# EAGLE design PCB-BC-BI (EAGLE 7.3.0)
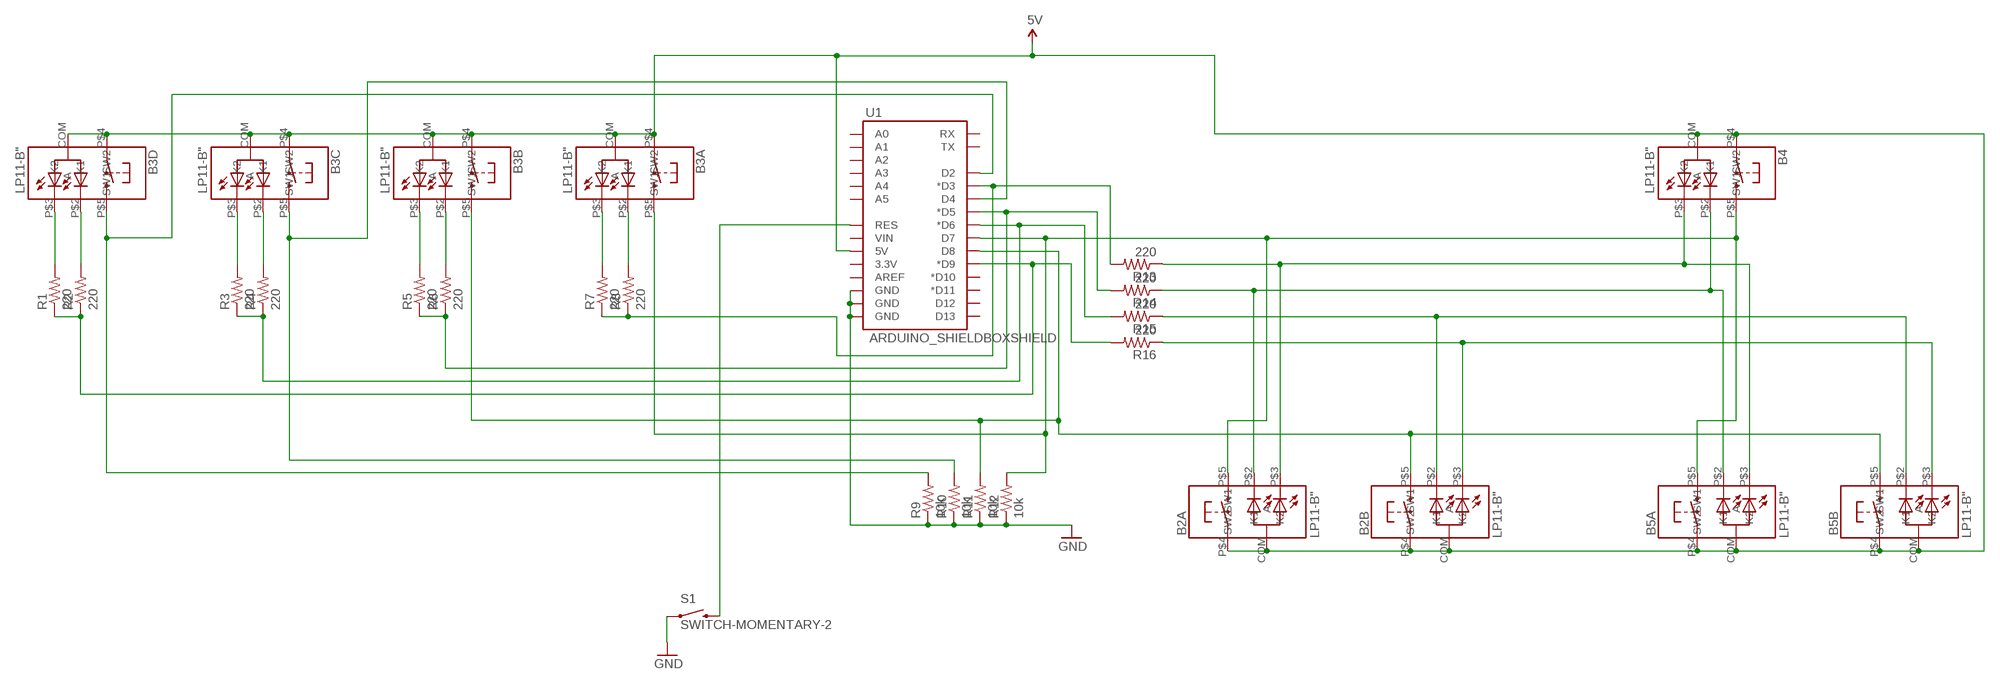
[diagram p0: schematic, sheet 1]

## Parts
B2A  LP11-B"  [LP11]
B2B  LP11-B"  [LP11]
B3A  LP11-B"  [LP11]
B3B  LP11-B"  [LP11]
B3C  LP11-B"  [LP11]
B3D  LP11-B"  [LP11]
B4  LP11-B"  [LP11]
B5A  LP11-B"  [LP11]
B5B  LP11-B"  [LP11]
R1  220  RESISTOR0603-RES  [0603-RES]
R2  220  RESISTOR0603-RES  [0603-RES]
R3  220  RESISTOR0603-RES  [0603-RES]
R4  220  RESISTOR0603-RES  [0603-RES]
R5  220  RESISTOR0603-RES  [0603-RES]
R6  220  RESISTOR0603-RES  [0603-RES]
R7  220  RESISTOR0603-RES  [0603-RES]
R8  220  RESISTOR0603-RES  [0603-RES]
R9  10k  RESISTOR0603-RES  [0603-RES]
R10  10k  RESISTOR0603-RES  [0603-RES]
R11  10k  RESISTOR0603-RES  [0603-RES]
R12  10k  RESISTOR0603-RES  [0603-RES]
R13  220  RESISTOR0603-RES  [0603-RES]
R14  220  RESISTOR0603-RES  [0603-RES]
R15  220  RESISTOR0603-RES  [0603-RES]
R16  220  RESISTOR0603-RES  [0603-RES]
S1  SWITCH-MOMENTARY-2  [TACTILE_SWITCH_TALL]
U1  ARDUINO_SHIELDBOXSHIELD  [ARDUINO_BOXSHIELD]

## Nets
5V: B2A.COM(A) B2A.P$4(SW1) B2B.COM(A) B2B.P$4(SW1) B3A.COM(A) B3A.P$4(SW1) B3B.COM(A) B3B.P$4(SW1) B3C.COM(A) B3C.P$4(SW1) B3D.COM(A) B3D.P$4(SW1) B4.COM(A) B4.P$4(SW1) B5A.COM(A) B5A.P$4(SW1) B5B.COM(A) B5B.P$4(SW1) U1.5V@0(5V)
GND: R9.1 R10.1 R11.1 R12.1 S1.A2 U1.GND@0(GND) U1.GND@1(GND) U1.GND@4(GND)
N$2: B3D.P$3(K2) R1.2
N$3: B2A.P$3(K2) B4.P$3(K2) B5A.P$3(K2) R13.1
N$4: B3D.P$2(K1) R2.2
N$5: B3C.P$3(K2) R3.2
N$6: B3C.P$2(K1) R4.2
N$7: B3C.P$5(SW2) R10.2 U1.4(D4)
N$8: R5.1 R6.1 R14.2 U1.5(*D5)
N$9: R3.1 R4.1 R15.2 U1.6(*D6)
N$10: R1.1 R2.1 R16.2 U1.9(*D9)
N$11: B2B.P$5(SW2) B3B.P$5(SW2) B5B.P$5(SW2) R11.2 U1.8(D8)
N$12: B2A.P$2(K1) B4.P$2(K1) B5A.P$2(K1) R14.1
N$13: B2B.P$2(K1) B5B.P$2(K1) R15.1
N$14: B2B.P$3(K2) B5B.P$3(K2) R16.1
N$15: B2A.P$5(SW2) B3A.P$5(SW2) B4.P$5(SW2) B5A.P$5(SW2) R12.2 U1.7(D7)
N$16: B3B.P$3(K2) R5.2
N$17: B3B.P$2(K1) R6.2
N$18: B3A.P$3(K2) R7.2
N$19: B3A.P$2(K1) R8.2
N$20: B3D.P$5(SW2) R9.2 U1.2(D2)
N$21: R7.1 R8.1 R13.2 U1.3(*D3)
N$23: S1.B2 U1.RESET(RES)
Unconnected: U1.0(RX) U1.1(TX) U1.3.3V U1.10(*D10) U1.11(*D11) U1.12(D12) U1.13(D13) U1.A0 U1.A1 U1.A2 U1.A3 U1.A4 U1.A5 U1.AREF U1.VIN

## Library data of the parts
B2A B2B B3A B3B B3C B3D B4 B5A B5B = SKAARHOJ:LP11-B
R1-R16 = SparkFun:RESISTOR: Resistor Basic schematic elements and footprints for 0603, 1206, and PTH resistors.
S1 = SparkFun:SWITCH-MOMENTARY-2
U1 = SKAARHOJ:ARDUINO_SHIELD

## Board
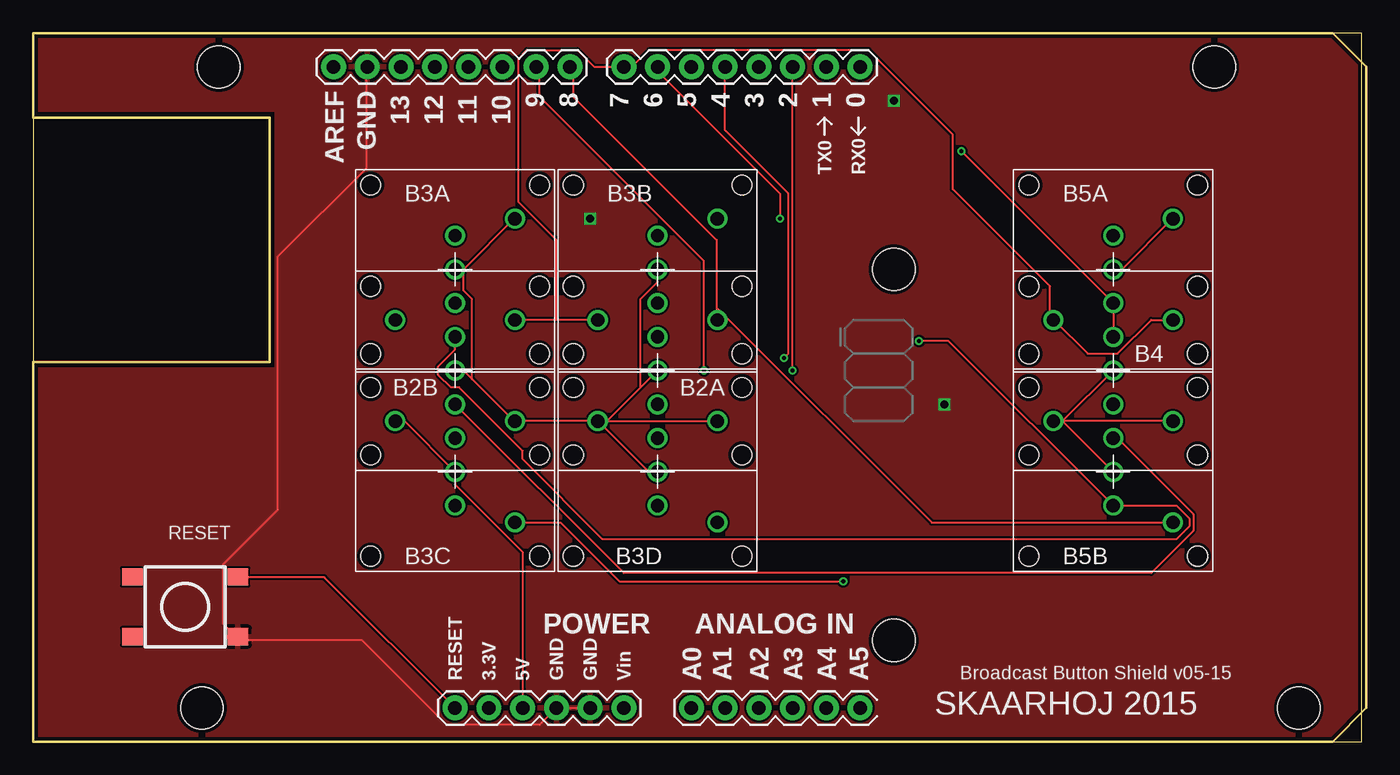
[diagram p1: board, top side]
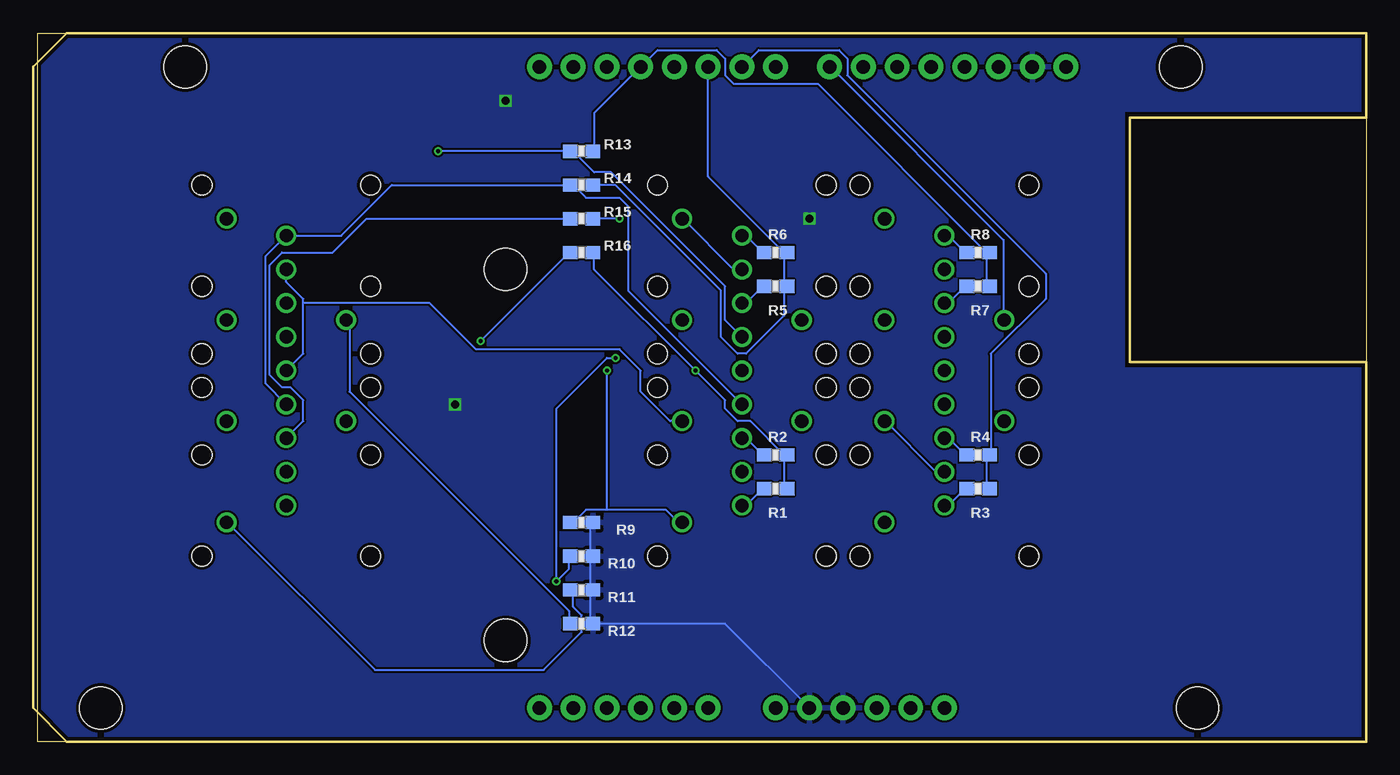
[diagram p2: board, bottom side, seen from below]

Size 100 x 53.33 mm. Coordinates in mm from the lower left corner, seen from the top.
Outline: 0,0 100,0 100,53.33 0,53.33 0,0
Copper layers (1*16): Top 0.035mm / dielectric 1.5mm / Bottom 0.035mm
Design rules "default": minimum track width 6mil, minimum drill 12mil, track to track 6mil, track to pad 6mil, pad to pad 6mil, via to via 6mil, smd to smd 0mil, copper to edge 10mil, drill to drill 10mil, minimum pad ring 10mil, minimum via ring 6mil, stop-mask expansion 2mil, vias tented up to drill 100mil, thermal gap 10mil

### Footprints (pad centres in the part's own frame; a part is rotated, then mirrored left to right if it is on the bottom)
LP11 = drill 1: COM 0,0; P$2 0,2.54; P$3 0,-2.54; P$4 4.5,3.81; P$5 4.5,-3.81 | hole 1.5: -6.35,6.35; 6.35,6.35; 6.35,-6.35; -6.35,-6.35
0603-RES = smd 1.1 x 1: 1 -0.85,0; 2 0.85,0
TACTILE_SWITCH_TALL = smd 1.55 x 1.3: A1 -3.975,-2.25; A2 3.975,-2.25; B1 -3.975,2.25; B2 3.975,2.25
ARDUINO_BOXSHIELD = drill 1.016 pad 1.88: 0 62.23,50.8; 1 59.69,50.8; 2 57.15,50.8; 3 54.61,50.8; 3.3V 34.29,2.54; 4 52.07,50.8; 5 49.53,50.8; 5V@0 36.83,2.54; 6 46.99,50.8; 7 44.45,50.8; 8 40.386,50.8; 9 37.846,50.8; 10 35.306,50.8; 11 32.766,50.8; 12 30.226,50.8; 13 27.686,50.8; A0 49.53,2.54; A1 52.07,2.54; A2 54.61,2.54; A3 57.15,2.54; A4 59.69,2.54; A5 62.23,2.54; AREF 22.606,50.8; GND@0 39.37,2.54; GND@1 41.91,2.54; GND@4 25.146,50.8; RESET 31.75,2.54; VIN 44.45,2.54 | hole 3.2: 13.97,50.8; 12.7,2.54; 64.77,35.56; 64.77,7.62; 88.9,50.8; 95.25,2.54

### Placement (x,y rotation side)
B2A  46.99,27.94 180 top
B2B  31.75,27.94 180 top
B3A  31.75,35.56 0 top
B3B  46.99,35.56 0 top
B3C  31.75,20.32 0 top
B3D  46.99,20.32 0 top
B4  81.28,27.94 180 top
B5A  81.28,35.56 0 top
B5B  81.28,20.32 0 top
R1  44.45,19.05 180 bottom
R2  44.45,21.59 180 bottom
R3  29.21,19.05 180 bottom
R4  29.21,21.59 180 bottom
R5  44.45,34.29 180 bottom
R6  44.45,36.83 180 bottom
R7  29.21,34.29 180 bottom
R8  29.21,36.83 180 bottom
R9  59.05,16.51 180 bottom
R10  59.05,13.97 180 bottom
R11  59.05,11.43 180 bottom
R12  59.05,8.89 180 bottom
R13  59.05,44.45 0 bottom
R14  59.05,41.91 0 bottom
R15  59.05,39.37 0 bottom
R16  59.05,36.83 0 bottom
S1  11.43,10.16 0 top
U1  0,0 0 top

### Tracks (layer width: path | path; a pad name or v marks a point on that pad's centre or on a via)
5V
  Top 0.152: B2B.P$4 27.94,24.13 B3C.COM 31.75,19.37 36.83,14.29 U1.5V@0 | B5A.COM 81.92,35.56 85.72,39.37 B5A.P$4 | B5B.P$4 77.47,24.13 | 77.47,24.13 B4.P$4 | 77.47,24.13 B5B.COM | 77.47,24.13 B4.COM | 32.38,35.56 36.2,39.37 B3A.P$4 | B2A.P$4 B3C.P$4 36.2,24.13 33.02,27.3 | B3D.COM 46.35,20.32 42.86,23.81 | 42.86,23.81 42.55,24.13 B2A.P$4 | B2B.COM 32.38,27.94 33.02,27.3 | 42.86,23.81 43.18,24.13 | 43.18,24.13 45.72,26.67 | 45.72,26.67 B2A.COM | 42.86,23.81 B2A.P$4 | 43.18,24.13 B3D.P$4 | 43.18,24.13 B2A.P$4 | 32.38,35.56 32.38,33.97 33.02,33.34 33.02,27.3 | 32.38,35.56 B3A.COM | B3B.COM 46.99,34.61 45.72,33.34 45.72,26.67
  Bottom 0.152: B5A.COM 81.28,34.61 80.01,33.34 80.01,33.02 | 80.01,33.02 80.01,29.21 B4.COM | B3B.COM 47.62,35.56 51.44,39.37 B3B.P$4 | 80.01,33.02 70.48,33.02 66.99,29.53 56.2,29.53 54.61,27.94 54.61,26.35 52.39,24.13 B3D.P$4 | B3C.COM 32.38,20.32 36.2,24.13 B3C.P$4
GND  (via drill 0.6)
  Top 0.152: U1.GND@4 25.08,50.8 25.08,43.18 18.41,36.51 18.41,17.46 14.29,13.34 14.29,8.89 15.24,7.94 S1.A2 15.56,7.62 24.77,7.62 31.11,1.27 38.1,1.27 U1.GND@0 U1.GND@1
  Bottom 0.152: 58.42,11.43 58.42,8.89 R12.1 48.26,8.89 U1.GND@1 | 58.42,13.97 58.42,16.51 R9.1 | 58.42,13.97 58.42,11.43 | 58.42,11.43 R11.1 | 58.42,13.97 R10.1
  other vias: 64.77,48.26 41.91,39.37 68.58,25.4
  pour Top: 0,0 100.33,0 100.33,53.34 0,53.34
  pour Bottom: 0,0 100.33,0 100.33,53.34 0,53.34
N$2
  Bottom 0.152: B3D.P$3 46.67,17.78 45.4,19.05 R1.2
N$3  (via drill 0.3)
  Top 0.152: B4.P$3 B5A.P$3 v69.85,44.45
  Bottom 0.152: B2A.P$3 48.26,31.75 48.26,34.29 56.83,42.86 58.1,42.86 59.69,44.45 R13.1 v69.85,44.45
N$4
  Bottom 0.152: B3D.P$2 46.67,22.86 45.4,21.59 R2.2
N$5
  Bottom 0.152: B3C.P$3 31.43,17.78 30.16,19.05 R3.2
N$6
  Bottom 0.152: B3C.P$2 31.43,22.86 30.16,21.59 R4.2
N$7  (via drill 0.3)
  Top 0.152: v60.96,12.06 44.13,12.06 39.69,16.51 B3C.P$5 | U1.4 52.07,46.04 56.83,41.27 56.83,29.21 v56.52,28.89
  Bottom 0.152: R10.2 60.01,13.97 60.01,13.02 v60.96,12.06 60.96,25.08 57.15,28.89 v56.52,28.89
N$8
  Bottom 0.152: 43.81,36.83 43.81,34.29 | R14.2 56.52,41.91 48.58,33.97 48.58,30.48 47.31,29.21 46.67,29.21 43.81,32.07 43.81,34.29 | 43.81,34.29 R5.1 | U1.5 49.53,42.55 43.81,36.83 | 43.81,36.83 R6.1
N$9  (via drill 0.3)
  Top 0.152: v56.2,39.37 56.2,41.27 46.99,50.48 U1.6
  Bottom 0.152: R3.1 28.57,19.05 28.57,21.59 R4.1 28.26,21.59 28.26,29.21 24.13,33.34 24.13,35.24 39.05,50.16 39.05,51.44 39.69,52.07 45.72,52.07 U1.6 | v56.2,39.37 R15.2
N$10  (via drill 0.3)
  Top 0.152: v50.48,27.94 50.48,36.2 38.1,48.58 38.1,50.8 U1.9
  Bottom 0.152: 43.81,21.59 43.81,19.05 R1.1 | 43.81,21.59 46.35,24.13 47.31,24.13 48.26,25.08 48.26,25.72 v50.48,27.94 58.1,35.56 58.1,36.83 R16.2 | 43.81,21.59 R2.1
N$11
  Top 0.152: 51.44,32.7 51.44,37.78 40.64,48.58 40.64,50.8 U1.8 | 51.44,32.7 51.44,31.75 B3B.P$5 | B5B.P$5 67.63,16.51 51.44,32.7
  Bottom 0.152: R11.2 59.69,11.43 59.69,10.16 59.05,9.53 59.05,8.26 61.91,5.4 74.61,5.4 85.72,16.51 B5B.P$5 | B2B.P$5 27.3,31.75 27.3,37.78 40.32,50.8 U1.8
N$12
  Bottom 0.152: B2A.P$2 55.56,33.97 55.56,40.32 56.2,40.96 58.74,40.96 59.69,41.91 R14.1 73.34,41.91 77.15,38.1 B5A.P$2 82.87,36.51 82.87,26.99 B4.P$2
N$13
  Top 0.152: B2B.P$2 44.45,12.7 84.14,12.7 87.31,15.88 87.31,17.14 81.6,22.86 B5B.P$2
  Bottom 0.152: R15.1 75.25,39.37 77.79,36.83 81.6,36.83 82.55,35.88 82.55,27.62 81.6,26.67 80.96,26.67 80.01,25.72 80.01,24.13 B5B.P$2
N$14  (via drill 0.3)
  Top 0.152: v66.67,30.16 68.9,30.16 B5B.P$3 86.04,17.78 87,16.83 87,16.19 86.04,15.24 42.86,15.24 36.83,21.27 36.83,21.91 32.07,26.67 31.43,26.67 30.48,27.62 30.48,28.26 31.75,29.53 B2B.P$3
  Bottom 0.152: v66.67,30.16 60.01,36.83 R16.1
N$15
  Top 0.152: B2A.P$5 39.37,31.75 | 39.37,31.75 B3A.P$5 | 39.37,31.75 39.37,37.78 36.51,40.64 36.51,51.44 37.15,52.07 40.96,52.07 42.23,50.8 U1.7 45.09,50.8 46.35,52.07 62.87,52.07 69.22,45.72 69.22,41.59 76.52,34.29 76.52,31.75 B4.P$5 76.83,31.75 79.38,29.21 81.6,29.21 84.14,31.75 B5A.P$5
  Bottom 0.152: R12.2 60.01,8.89 60.01,9.84 76.52,26.35 76.52,31.75 B4.P$5
N$16
  Bottom 0.152: B3B.P$3 46.67,33.02 45.4,34.29 R5.2
N$17
  Bottom 0.152: B3B.P$2 46.67,38.1 45.4,36.83 R6.2
N$18
  Bottom 0.152: B3A.P$3 31.43,33.02 30.16,34.29 R7.2
N$19
  Bottom 0.152: B3A.P$2 31.43,38.1 30.16,36.83 R8.2
N$20  (via drill 0.3)
  Top 0.152: v57.15,27.94 U1.2
  Bottom 0.152: 57.15,17.46 52.7,17.46 51.75,16.51 B3D.P$5 | 57.15,17.46 58.74,17.46 59.69,16.51 R9.2 | 57.15,17.46 v57.15,27.94
N$21
  Bottom 0.152: 28.57,36.83 28.57,34.29 R7.1 | R13.2 58.1,44.45 58.1,47.31 U1.3 53.34,52.07 48.9,52.07 48.26,51.44 48.26,50.16 47.62,49.53 41.27,49.53 28.57,36.83 | 28.57,36.83 R8.1
N$23
  Top 0.152: U1.RESET 21.91,12.38 15.56,12.38 S1.B2

### Text on the board
_tsilk: RESET | Broadcast Button Shield v05-15 | SKAARHOJ 2015